# EAGLE schematic power_supply (EAGLE 9.6.2)
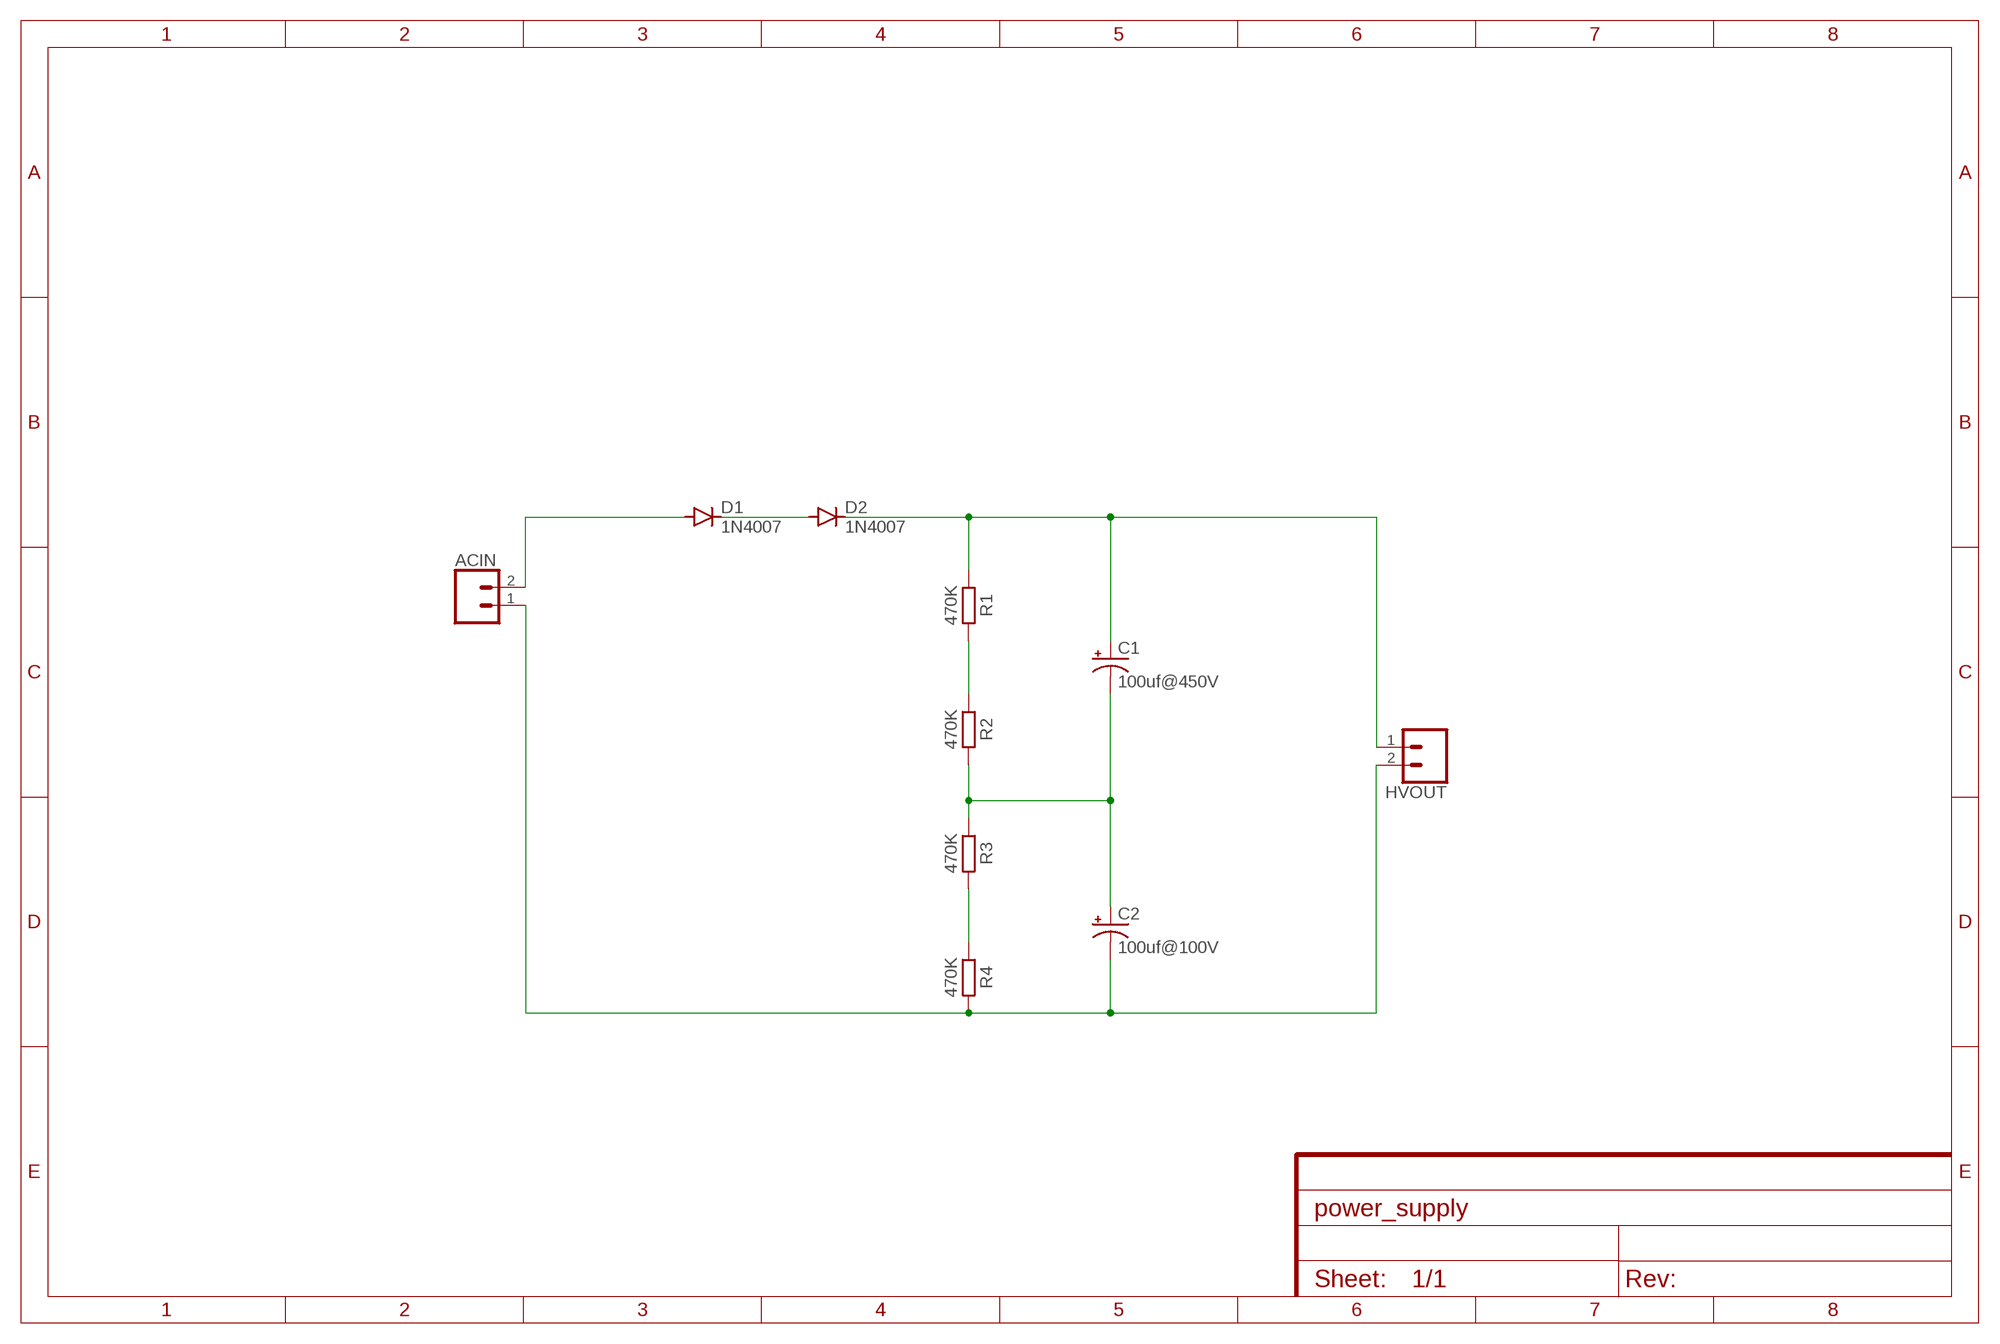
[diagram p0: schematic, sheet 1]

## Parts
ACIN  CONN_02  [1X02]
C1  100uf@450V  CPOL-USE5-6  [E5-6]
C2  100uf@100V  CPOL-USE5-6  [E5-6]
D1  1N4007  1N4004  [DO41-10]
D2  1N4007  1N4004  [DO41-10]
HVOUT  CONN_02  [1X02]
R1  470K  R_AXIAL-11.7MM-PITCH  [RESAD1176W63L850D250B]
R2  470K  R_AXIAL-11.7MM-PITCH  [RESAD1176W63L850D250B]
R3  470K  R_AXIAL-11.7MM-PITCH  [RESAD1176W63L850D250B]
R4  470K  R_AXIAL-11.7MM-PITCH  [RESAD1176W63L850D250B]

## Nets
N$1: D1.C D2.A
N$2: C1.+ D2.C HVOUT.1 R1.1
N$3: R1.2 R2.1
N$4: C1.- C2.+ R2.2 R3.1
N$5: R3.2 R4.1
N$6: ACIN.1 C2.- HVOUT.2 R4.2
N$8: ACIN.2 D1.A

## Library data of the parts
ACIN HVOUT = SparkFun-Connectors:CONN_02: Multi connection point. Often used as Generic Header-pin footprint for 0.1 inch spaced/style header connections On any of the 0.1 inch spaced packages, you can populate with these: Break Away Headers - Straight <https://www.sparkfun.com/products/116> (PRT-00116) Break Away Male Headers - Right Angle <https://www.sparkfun.com/products/553> (PRT-00553) Female Headers <https://www.sparkfun.com/products/115> (PRT-00115) Break Away Headers - Machine Pin <https://www.sparkfun.com/products/117> (PRT-00117) Break Away Female Headers - Swiss Machine Pin <https://www.sparkfun.com/products/743> (PRT-00743) For SCREWTERMINALS and SPRING TERMINALS visit here: Screw Terimnals on SparkFun.com <https://www.sparkfun.com/search/results?term=Screw+Terminals> (5mm/3.5mm/2.54mm spacing) This device is also useful as a general connection point to wire up your design to another part of your project. Our various solder wires solder well into these plated through hole pads. Hook-Up Wire - Assortment (Stranded, 22 AWG) <https://www.sparkfun.com/products/11375> (PRT-11375) Hook-Up Wire - Assortment (Solid Core, 22 AWG) <https://www.sparkfun.com/products/11367> (PRT-11367) View the entire wire category on our website here <https://www.sparkfun.com/categories/141> Special notes: Molex polarized connector foot print use with: PRT-08233 with associated crimp pins and housings. 2.54_SCREWTERM for use with PRT-10571. 3.5mm Screw Terminal footprints for PRT-08084 5mm Screw Terminal footprints for use with PRT-08432
C1 C2 = rcl:CPOL-US: POLARIZED CAPACITOR, American symbol; SPICEPREFIX: C
D1 D2 = diode:1N4004: DIODE general purpose rectifier, 1 A
R1-R4 = Resistor:R: Resistor Fixed - Generic; CATEGORY: Resistor; SUB-CATEGORY: Fixed